# Altium schematic sheet Navigator_Core.SchDoc: The Ad-Flier - Navigation Processor Core
size A; DrawnBy: David J. Greene; Engineer: David J. Greene; DocumentNumber: 2; SheetNumber: 2; SheetTotal: 8; DocumentName: Navigator Processor Core; ProjectName: The Ad-Flier
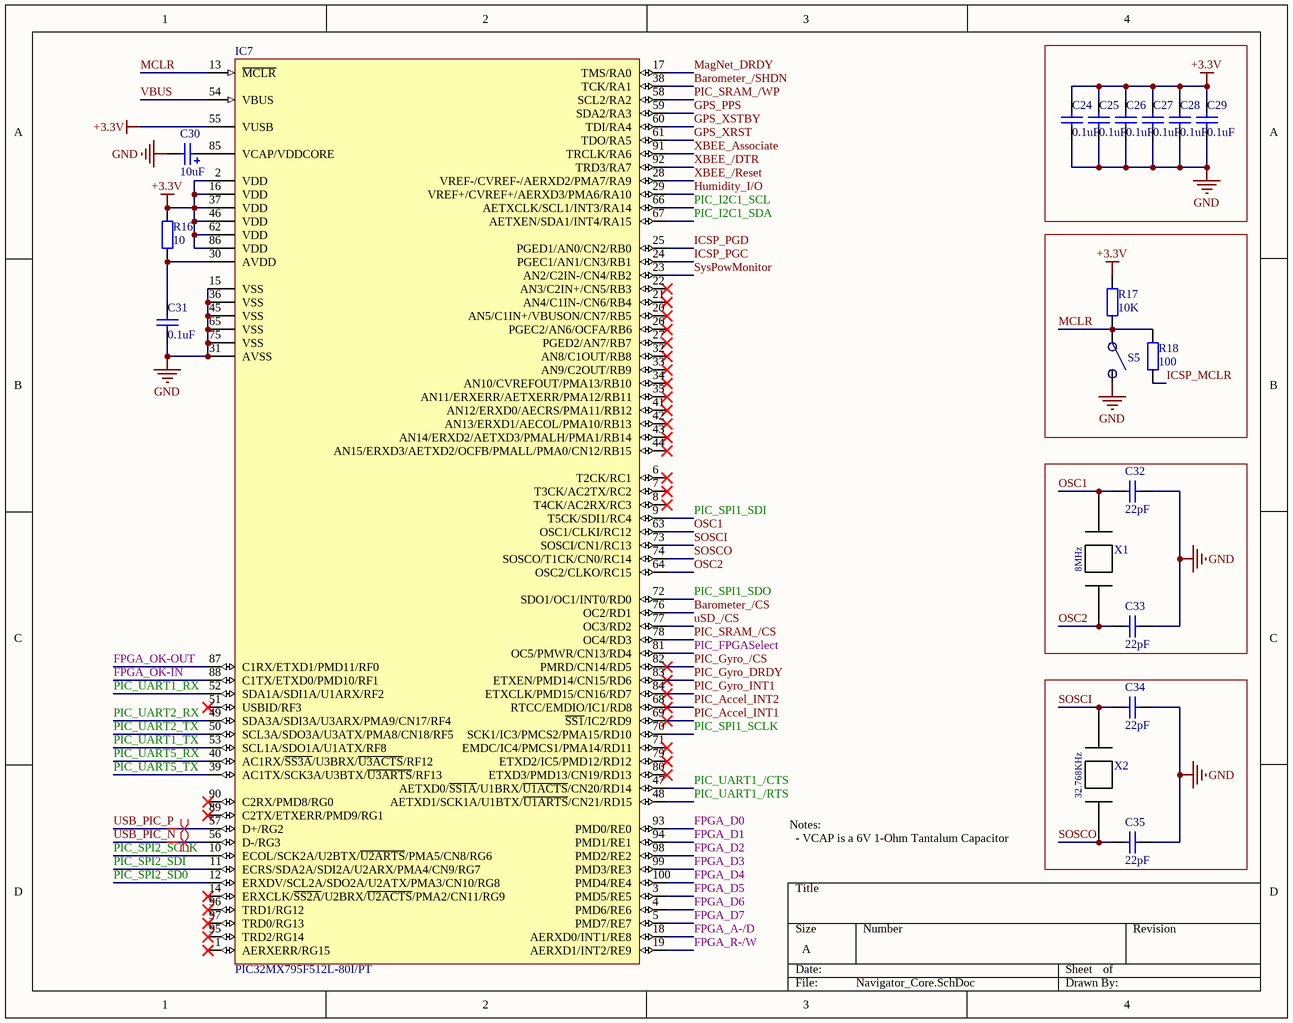
[diagram p0: Navigator_Core.SchDoc]

## Parts
C24  value 0.1uF  [SMD 1206]  (hidden comment: 0.1uF SMD 1206)
C25  value 0.1uF  [SMD 1206]  (hidden comment: 0.1uF SMD 1206)
C26  value 0.1uF  [SMD 1206]  (hidden comment: 0.1uF SMD 1206)
C27  value 0.1uF  [SMD 1206]  (hidden comment: 0.1uF SMD 1206)
C28  value 0.1uF  [SMD 1206]  (hidden comment: 0.1uF SMD 1206)
C29  value 0.1uF  [SMD 1206]  (hidden comment: 0.1uF SMD 1206)
C30  value 10uF  [Capacitor - Tantalum Case A]  (hidden comment: 10uF Low-ESR Tantalum CaseA)
C31  value 0.1uF  [SMD 1206]  (hidden comment: 0.1uF SMD 1206)
C32  value 22pF  [SMD 1206]  (hidden comment: 22pF SMD 1206)
C33  value 22pF  [SMD 1206]  (hidden comment: 22pF SMD 1206)
C34  value 22pF  [SMD 1206]  (hidden comment: 22pF SMD 1206)
C35  value 22pF  [SMD 1206]  (hidden comment: 22pF SMD 1206)
IC7  PIC32MX795F512L-80I/PT  [TQFP-PF100_L]
R16  value 10  [SMD 0805]  (hidden comment: 10 SMD 0805)
R17  value 10K  [SMD 0805]  (hidden comment: 10K SMD 0805)
R18  value 100  [SMD 0805]  (hidden comment: 100 SMD 0805)
S5  SMD Tactile Switch  [SMD Tactile Switch]  (value not drawn)
X1  XT9M20ANA8M  [XT9M20ANA8M - 8MHz Capacitor]  (value not drawn)
X2  SSP-T6-7PF-20PPM  [32.768KHz Crystal]  (value not drawn)

## Nets
+3.3V: C24.1 C25.1 C26.1 C27.1 C28.1 C29.1 IC7.2(VDD) IC7.16(VDD) IC7.37(VDD) IC7.46(VDD) IC7.55(VUSB) IC7.62(VDD) IC7.86(VDD) R16.2 R17.2
GND: C24.2 C25.2 C26.2 C27.2 C28.2 C29.2 C30.2(-) C31.2 C32.1 C33.1 C34.1 C35.1 IC7.15(VSS) IC7.31(AVSS) IC7.36(VSS) IC7.45(VSS) IC7.65(VSS) IC7.75(VSS) S5.1
Barometer_/CS: IC7.76(OC2/RD1)
Barometer_/SHDN: IC7.38(TCK/RA1)
FPGA_A-/D: IC7.18(AERXD0/INT1/RE8)
FPGA_D0: IC7.93(PMD0/RE0)
FPGA_D1: IC7.94(PMD1/RE1)
FPGA_D2: IC7.98(PMD2/RE2)
FPGA_D3: IC7.99(PMD3/RE3)
FPGA_D4: IC7.100(PMD4/RE4)
FPGA_D5: IC7.3(PMD5/RE5)
FPGA_D6: IC7.4(PMD6/RE6)
FPGA_D7: IC7.5(PMD7/RE7)
FPGA_OK-IN: IC7.88(C1TX/ETXD0/PMD10/RF1)
FPGA_OK-OUT: IC7.87(C1RX/ETXD1/PMD11/RF0)
FPGA_R-/W: IC7.19(AERXD1/INT2/RE9)
GPS_PPS: IC7.59(SDA2/RA3)
GPS_XRST: IC7.61(TDO/RA5)
GPS_XSTBY: IC7.60(TDI/RA4)
Humidity_I/O: IC7.29(VREF+/CVREF+/AERXD3/PMA6/RA10)
ICSP_MCLR: R18.2
ICSP_PGC: IC7.24(PGEC1/AN1/CN3/RB1)
ICSP_PGD: IC7.25(PGED1/AN0/CN2/RB0)
MagNet_DRDY: IC7.17(TMS/RA0)
MCLR: IC7.13(~{MCLR}) R17.1 R18.1 S5.2
OSC1: C32.2 IC7.63(OSC1/CLKI/RC12) X1.1
OSC2: C33.2 IC7.64(OSC2/CLKO/RC15) X1.0
PIC_Accel_INT1: IC7.69(~{SS1}/IC2/RD9)
PIC_Accel_INT2: IC7.68(RTCC/EMDIO/IC1/RD8)
PIC_FPGASelect: IC7.81(OC5/PMWR/CN13/RD4)
PIC_Gyro_/CS: IC7.82(PMRD/CN14/RD5)
PIC_Gyro_DRDY: IC7.83(ETXEN/PMD14/CN15/RD6)
PIC_Gyro_INT1: IC7.84(ETXCLK/PMD15/CN16/RD7)
PIC_I2C1_SCL: IC7.66(AETXCLK/SCL1/INT3/RA14)
PIC_I2C1_SDA: IC7.67(AETXEN/SDA1/INT4/RA15)
PIC_SPI1_SCLK: IC7.70(SCK1/IC3/PMCS2/PMA15/RD10)
PIC_SPI1_SDI: IC7.9(T5CK/SDI1/RC4)
PIC_SPI1_SDO: IC7.72(SDO1/OC1/INT0/RD0)
PIC_SPI2_SCLK: IC7.10(ECOL/SCK2A/U2BTX/~{U2ARTS}/PMA5/CN8/RG6)
PIC_SPI2_SD0: IC7.12(ERXDV/SCL2A/SDO2A/U2ATX/PMA3/CN10/RG8)
PIC_SPI2_SDI: IC7.11(ECRS/SDA2A/SDI2A/U2ARX/PMA4/CN9/RG7)
PIC_SRAM_/CS: IC7.78(OC4/RD3)
PIC_SRAM_/WP: IC7.58(SCL2/RA2)
PIC_UART1_/CTS: IC7.47(AETXD0/~{SS1A}/U1BRX/~{U1ACTS}/CN20/RD14)
PIC_UART1_/RTS: IC7.48(AETXD1/SCK1A/U1BTX/~{U1ARTS}/CN21/RD15)
PIC_UART1_RX: IC7.52(SDA1A/SDI1A/U1ARX/RF2)
PIC_UART1_TX: IC7.53(SCL1A/SDO1A/U1ATX/RF8)
PIC_UART2_RX: IC7.49(SDA3A/SDI3A/U3ARX/PMA9/CN17/RF4)
PIC_UART2_TX: IC7.50(SCL3A/SDO3A/U3ATX/PMA8/CN18/RF5)
PIC_UART5_RX: IC7.40(AC1RX/~{SS3A}/U3BRX/~{U3ACTS}/RF12)
PIC_UART5_TX: IC7.39(AC1TX/SCK3A/U3BTX/~{U3ARTS}/RF13)
SOSCI: C34.2 IC7.73(SOSCI/CN1/RC13) X2.0
SOSCO: C35.2 IC7.74(SOSCO/T1CK/CN0/RC14) X2.1
SysPowMonitor: IC7.23(AN2/C2IN-/CN4/RB2)
USB_PIC_N: IC7.56(D-/RG3)
USB_PIC_P: IC7.57(D+/RG2)
uSD_/CS: IC7.77(OC3/RD2)
VBUS: IC7.54(VBUS)
XBEE_/DTR: IC7.92(TRD3/RA7)
XBEE_/Reset: IC7.28(VREF-/CVREF-/AERXD2/PMA7/RA9)
XBEE_Associate: IC7.91(TRCLK/RA6)
NetC30_1: C30.1(+) IC7.85(VCAP/VDDCORE)
NetC31_1: C31.1 IC7.30(AVDD) R16.1

Not connected (* = marked no-connect by the designer): IC7 1(AERXERR/RG15)* 6(T2CK/RC1)* 7(T3CK/AC2TX/RC2)* 8(T4CK/AC2RX/RC3)* 14(ERXCLK/~{SS2A}/U2BRX/~{U2ACTS}/PMA2/CN11/RG9)* 20(AN5/C1IN+/VBUSON/CN7/RB5)* 21(AN4/C1IN-/CN6/RB4)* 22(AN3/C2IN+/CN5/RB3)* 26(PGEC2/AN6/OCFA/RB6)* 27(PGED2/AN7/RB7)* 32(AN8/C1OUT/RB8)* 33(AN9/C2OUT/RB9)* 34(AN10/CVREFOUT/PMA13/RB10)* 35(AN11/ERXERR/AETXERR/PMA12/RB11)* 41(AN12/ERXD0/AECRS/PMA11/RB12)* 42(AN13/ERXD1/AECOL/PMA10/RB13)* 43(AN14/ERXD2/AETXD3/PMALH/PMA1/RB14)* 44(AN15/ERXD3/AETXD2/OCFB/PMALL/PMA0/CN12/RB15)* 51(USBID/RF3)* 71(EMDC/IC4/PMCS1/PMA14/RD11)* 79(ETXD2/IC5/PMD12/RD12)* 80(ETXD3/PMD13/CN19/RD13)* 89(C2TX/ETXERR/PMD9/RG1)* 90(C2RX/PMD8/RG0)* 95(TRD2/RG14)* 96(TRD1/RG12)* 97(TRD0/RG13)*

## Layout directives
differential pair: USB_PIC_N, USB_PIC_P

## Notes on the sheet
- Notes:
  - VCAP is a 6V 1-Ohm Tantalum Capacitor
- (in symbol SSP-T6-7PF-20PPM) 32.768KHz
- (in symbol XT9M20ANA8M) 8MHz

## Library data of the parts
C24-C29 C31-C35 = Cap: Capacitor
C30 = SMD_Cap_Tantalum: Tantalum Capacitor - Case A
IC7 = PIC32MX795F512L-80I/PT: High Performance 80 MHz MIPS-Based 32-Bit Flash Microcontroller with USB, CAN and Ethernet, 512KB Program Memory, 100-pin TQFP, Industrial Temperature; Published: 2-Dec-2009; DatasheetVersion: revB, Nov-2009; PackageVersion: revBB, Aug-2009; PackageReference: TQFP-PT100; Publisher: Altium Limited; PackageDescription: 100-Lead Plastic Thin Quad Flatpack (PT) - 12x12x1mm Body, 2.00mm [TQFP]; Supplier 1: Digi-Key; Supplier Part Number 1: PIC32MX795F512L-80I/PT-ND; Supplier 2: Farnell; Supplier Part Number 2: 1778492; ComponentLink1Description: Datasheet; ComponentLink1URL: http://ww1.microchip.com/downloads/en/DeviceDoc/DS-61156B.pdf; ComponentLink2Description: Packaging Specification; ComponentLink2URL: http://ww1.microchip.com/downloads/en/PackagingSpec/en012702.pdf; ComponentLink3Description: Microchip.com Home; ComponentLink3URL: http://www.microchip.com/
R16-R18 = Res2: Resistor
X1 = XT9M20ANA8M: 8MHz SMD Crystal; pin to pad: 0>1 1>2
X2 = SSP-T6-7PF-20PPM: 32.768KHz 7pF SMD Crystal; pin to pad: 0>1 1>2